# Altium schematic sheet MCU.SchDoc
size A; SheetNumber: 3; SheetTotal: 4
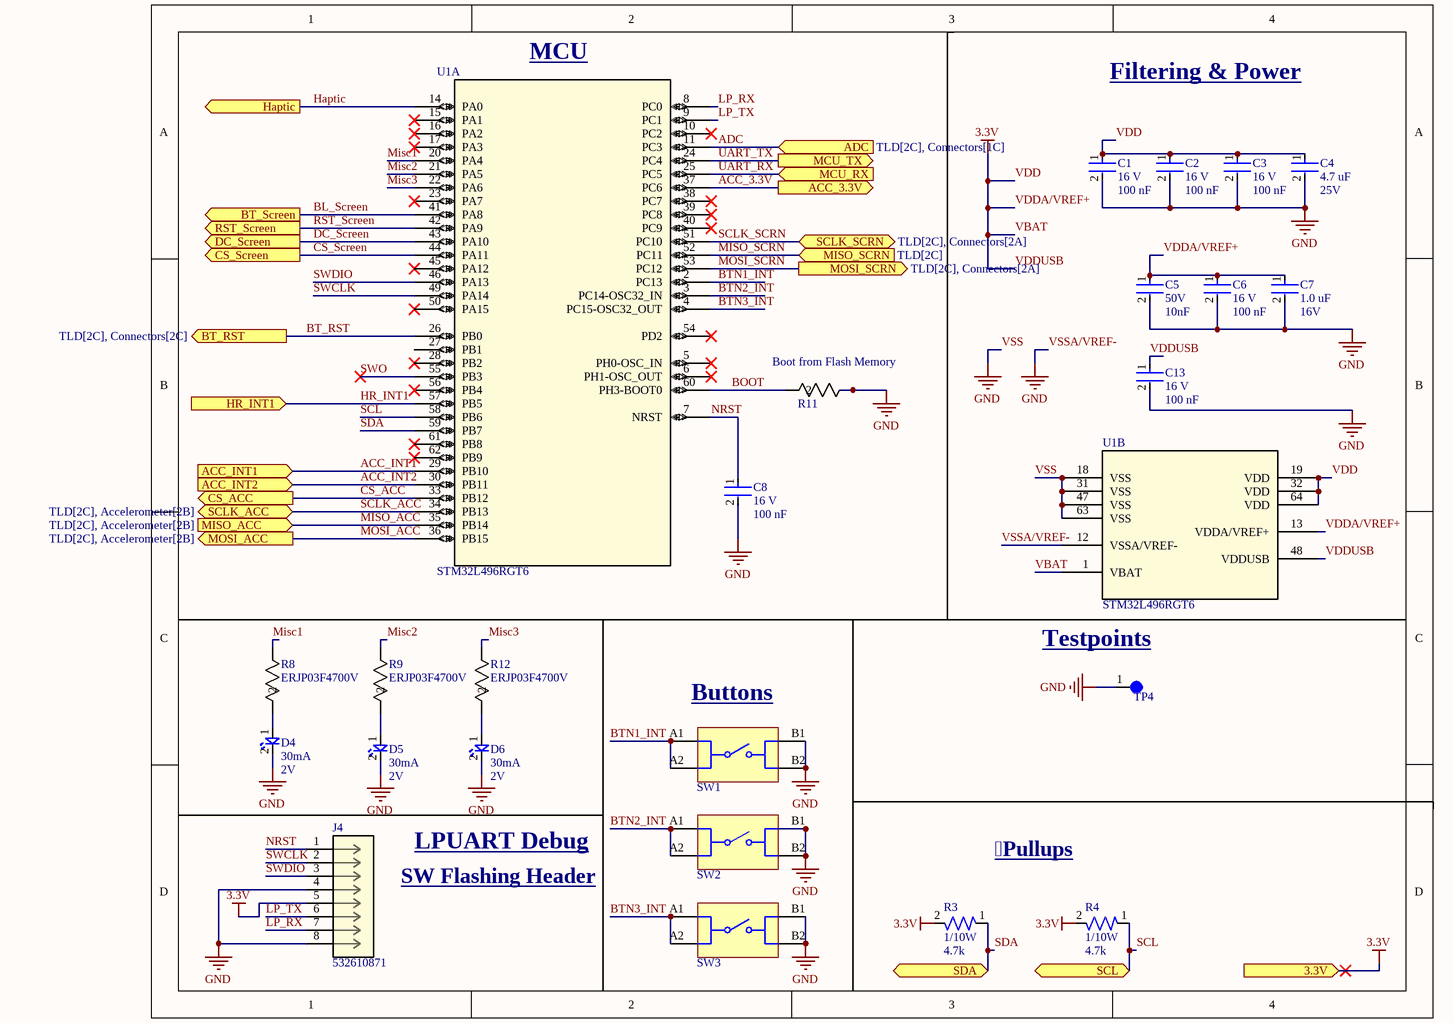
[diagram p0: MCU.SchDoc]

## Parts
C1  Voltage Rating: 16 V  Capacitance: 100 nF  [CAP-0402]  (hidden comment: CC0402KRX7R7BB104)
C2  Voltage Rating: 16 V  Capacitance: 100 nF  [CAP-0402]  (hidden comment: CC0402KRX7R7BB104)
C3  Voltage Rating: 16 V  Capacitance: 100 nF  [CAP-0402]  (hidden comment: CC0402KRX7R7BB104)
C4  Capacitance: 4.7 uF  Voltage: 25V  [CAP-0603]  (hidden comment: CC0603KRX5R8BB475)
C5  Voltage: 50V  Capacitance: 10nF  [CAP-0805]  (hidden comment: GRM2195C1H103JA01D)
C6  Voltage Rating: 16 V  Capacitance: 100 nF  [CAP-0402]  (hidden comment: CC0402KRX7R7BB104)
C7  Capacitance: 1.0 uF  Voltage: 16V  [CAP-0603]  (hidden comment: CC0603KRX7R7BB105)
C8  Voltage Rating: 16 V  Capacitance: 100 nF  [CAP-0402]  (hidden comment: CC0402KRX7R7BB104)
C13  Voltage Rating: 16 V  Capacitance: 100 nF  [CAP-0402]  (hidden comment: CC0402KRX7R7BB104)
D4  Forward Current: 30mA  Forward Voltage: 2V  [LED-0603]  (hidden comment: BL-HKC36G-AV-TRB)
D5  Forward Current: 30mA  Forward Voltage: 2V  [LED-0603]  (hidden comment: BL-HKC36G-AV-TRB)
D6  Forward Current: 30mA  Forward Voltage: 2V  [LED-0603]  (hidden comment: BL-HKC36G-AV-TRB)
J4  532610871  [CONN_532610001-SD_08_MOL]
R3  Power: 1/10W  Resistance: 4.7k  [RES-0603]  (hidden comment: RC0603FR-074K7L)
R4  Power: 1/10W  Resistance: 4.7k  [RES-0603]  (hidden comment: RC0603FR-074K7L)
R8  ERJP03F4700V  [RES_ERJP03_PAN]
R9  ERJP03F4700V  [RES_ERJP03_PAN]
R11  CRCW12100000Z0EA  [RES_CRCW_1210_VIS]  (value not drawn)
R12  ERJP03F4700V  [RES_ERJP03_PAN]
SW1  434351045816  [434351045816]  (value not drawn)
SW2  434351045816  [434351045816]  (value not drawn)
SW3  434351045816  [434351045816]  (value not drawn)
TP4  5003  [TEST-POINT-0001]  (value not drawn)
U1  STM32L496RGT6  [LQFP64-10x10mm_STM]  (parts A,B of 2)

## Ports
3.3V (in, see TLD[2B], Connectors[4D], LDOs[1A]), ACC_3.3V (out, see TLD[3C], Accelerometer[4D]), ACC_INT1 (in, see TLD[2C], Accelerometer[2B]), ACC_INT2 (in, see TLD[2C], Accelerometer[2B]), ADC (in, see TLD[2C], Connectors[1C]), BT_RST (out, see TLD[2C], Connectors[2C]), BT_Screen (out, see TLD[3B]), CS_ACC (out, see TLD[3C], Accelerometer[2B]), CS_Screen (out, see TLD[3C], Connectors[2A]), DC_Screen (out, see TLD[3B], Connectors[2A]), Haptic (out, see TLD[3C], Connectors[1B]), HR_INT1 (in, see TLD[2C], Connectors[1B]), MCU_RX (in, see TLD[3C]), MCU_TX (out, see TLD[3C]), MISO_ACC (in, see TLD[2C], Accelerometer[2B]), MISO_SCRN (in, see TLD[2C]), MOSI_ACC (out, see TLD[2C], Accelerometer[2B]), MOSI_SCRN (out, see TLD[2C], Connectors[2A]), RST_Screen (out, see TLD[3B], Connectors[2A]), SCL (bidir, see TLD[3C], Connectors[1B]), SCLK_ACC (bidir, see TLD[2C], Accelerometer[2B]), SCLK_SCRN (bidir, see TLD[2C], Connectors[2A]), SDA (bidir, see TLD[3C], Connectors[1B])

## Nets
VBAT: C1.1 C2.1 C3.1 C4.1 C5.1 C6.1 C7.1 C13.1 J4.5 R3.2 R4.2 U1.1(VBAT) U1.13(VDDA/VREF+) U1.19(VDD) U1.32(VDD) U1.48(VDDUSB) U1.64(VDD) ; port 3.3V  [also labelled 3.3V, VDD, VDDA/VREF+, VDDUSB]
VSS: C1.2 C2.2 C3.2 C4.2 C5.2 C6.2 C7.2 C8.2 C13.2 D4.2 D5.2 D6.2 J4.4 J4.8 R11.1 SW1.B1 SW1.B2 SW2.B1 SW2.B2 SW3.B1 SW3.B2 TP4.1 U1.12(VSSA/VREF-) U1.18(VSS) U1.31(VSS) U1.47(VSS) U1.63(VSS)  [also labelled GND, VSSA/VREF-]
ACC_3.3V: U1.37(PC6) ; port ACC_3.3V
ACC_INT1: U1.29(PB10) ; port ACC_INT1
ACC_INT2: U1.30(PB11) ; port ACC_INT2
ADC: U1.11(PC3) ; port ADC
BL_Screen: U1.41(PA8) ; port BT_Screen
BOOT: R11.2 U1.60(PH3-BOOT0)
BT_RST: U1.26(PB0) ; port BT_RST
BTN1_INT: SW1.A1 SW1.A2 U1.2(PC13)
BTN2_INT: SW2.A1 SW2.A2 U1.3(PC14-OSC32_IN)
BTN3_INT: SW3.A1 SW3.A2 U1.4(PC15-OSC32_OUT)
CS_ACC: U1.33(PB12) ; port CS_ACC
CS_Screen: U1.44(PA11) ; port CS_Screen
DC_Screen: U1.43(PA10) ; port DC_Screen
Haptic: U1.14(PA0) ; port Haptic
HR_INT1: U1.57(PB5) ; port HR_INT1
LP_RX: J4.7 U1.8(PC0)
LP_TX: J4.6 U1.9(PC1)
Misc1: R8.1 U1.20(PA4)
Misc2: R9.1 U1.21(PA5)
Misc3: R12.1 U1.22(PA6)
MISO_ACC: U1.35(PB14) ; port MISO_ACC
MISO_SCRN: U1.52(PC11) ; port MISO_SCRN
MOSI_ACC: U1.36(PB15) ; port MOSI_ACC
MOSI_SCRN: U1.53(PC12) ; port MOSI_SCRN
NRST: C8.1 J4.1 U1.7(NRST)
RST_Screen: U1.42(PA9) ; port RST_Screen
SCL: R4.1 U1.58(PB6) ; port SCL
SCLK_ACC: U1.34(PB13) ; port SCLK_ACC
SCLK_SCRN: U1.51(PC10) ; port SCLK_SCRN
SDA: R3.1 U1.59(PB7) ; port SDA
SWCLK: J4.2 U1.49(PA14)
SWDIO: J4.3 U1.46(PA13)
SWO: U1.55(PB3)
UART_RX: U1.25(PC5) ; port MCU_RX
UART_TX: U1.24(PC4) ; port MCU_TX
NetD4_1: D4.1 R8.2
NetD5_1: D5.1 R9.2
NetD6_1: D6.1 R12.2

Not connected (* = marked no-connect by the designer): U1 5(PH0-OSC_IN)* 6(PH1-OSC_OUT)* 10(PC2)* 15(PA1)* 16(PA2)* 17(PA3)* 23(PA7)* 27(PB1) 28(PB2)* 38(PC7)* 39(PC8)* 40(PC9)* 45(PA12)* 50(PA15)* 54(PD2)* 56(PB4)* 61(PB8)* 62(PB9)*

## Notes on the sheet
- (near U1) MCU
- Filtering & Power
- (near R11) Boot from Flash Memory
- (near SW1) Buttons
- Testpoints
- SW Flashing Header
- LPUART Debug
- Pullups

## Library data of the parts
C1-C3 C6 C8 C13 = CAP-0.1U-0001: CAP CER 0.1UF 16V X7R 0402; ComponentLink2Description: Datasheet; ComponentLink2URL: https://www.yageo.com/upload/media/product/productsearch/datasheet/mlcc/UPY-GPHC_X7R_6.3V-to-250V_24.pdf; Device Class: Ceramic; Size: 0402
C4 = CAP-4.7U-0001: CAP CER 4.7UF 25V X5R 0603; Device Class: Ceramic; Size: 0603
C5 = CAP-10N-0001: CAP CER 10000PF 50V C0G/NP0 0805; Device Class: Ceramic; Size: 0805; ComponentLink1Description: Datasheet; ComponentLink1URL: https://search.murata.co.jp/Ceramy/image/img/A01X/G101/ENG/GRM2195C1H103JA01-01.pdf
C7 = CAP-1U-0002: CAP CER 1UF 16V X7R 0603; Device Class: Ceramic; Size: 0603
D4-D6 = LED-0001: LED YELLOW CLEAR 0603 SMD; ComponentLink1Description: Datasheet; ComponentLink1URL: https://www.americanbrightled.com/pdffiles/led-components/smt/BL-HKC36G-AV-TRB.pdf
J4 = Header-PICO-8: No Description Available; Mfr_Name: Molex Connector Corporation; RefDes: RefDes; Type: Type; ComponentLink1Description: Datasheet; ComponentLink1URL: https://www.molex.com/content/dam/molex/molex-dot-com/products/automated/en-us/salesdrawingpdf/532/53261/532610871_sd.pdf?inline
R3 R4 = RES-4.7k-0001: RES 4.7K OHM 1% 1/10W 0603; Tolerance: 1%; Size: 0603; ComponentLink1Description: Datasheet; ComponentLink1URL: https://www.yageo.com/upload/media/product/products/datasheet/rchip/PYu-RC_Group_51_RoHS_L_12.pdf
R8 R9 R12 = RES-470-0603: 470 Ohms ±1% 0.2W, 1/5W Chip Resistor 0603 (1608 Metric) Automotive AEC-Q200, Pulse Withstanding Thick Film; Mfr_Name: Panasonic; ComponentLink1Description: Datasheet; ComponentLink1URL: https://industrial.panasonic.com/cdbs/www-data/pdf/RDO0000/AOA0000C331.pdf
R11 = RES-0-1: No Description Available; Mfr_Name: Vishay; ComponentLink1Description: Datasheet; ComponentLink1URL: https://www.vishay.com/docs/20035/dcrcwe3.pdf
SW1-SW3 = Button-NO-90_1: WS-TASU SMT Tact Switch 4.7x3.5mm side push, SPST-NO, 12VDC, 50mA, 160g; Manufacturer: Wurth Elektronik; Washable: No; ComponentLink1Description: Website Link; ComponentLink1URL: https://www.we-online.com/redexpert/article/434351045816?ad; ComponentLink2Description: Datasheet Link; ComponentLink2URL: https://www.we-online.com/redexpert/spec/434351045816?ad; Manufacturer Part Number: 434351045816; Category: Tact Switches; Match Code: WS-TASU; Mount: Surface Mount; Operating Temperature Max: 85°C; Operating Temperature Min: -40°C; Packaging: Tape and Reel; Length: 4.7mm; Width: 3.5mm; Height: 1.65mm; Circuit: SPST-NO; Contact Material: Stainless Steel; Contact Plating: Silver; Operation Force: 160g; Rated Current: 50mA; Rated Voltage: 12VDC; Terminal Material: Copper Alloy; Terminal Plating: Silver
TP4 = TEST-POINT-0001: Oranange PC Test Point, Miniature Phoisphor Bronze Silver Plating Through Hole Mounting Type
U1 = STM32L496RGT6: ARM® Cortex®-M4 STM32L4 Microcontroller IC 32-Bit Single-Core 80MHz 1MB (1M x 8) FLASH 64-LQFP (10x10); Mfr_Name: STMicroelectronics; RefDes: RefDes; Type: Type; ComponentLink1Description: Datasheet; ComponentLink1URL: https://www.st.com/resource/en/datasheet/stm32l496ae.pdf